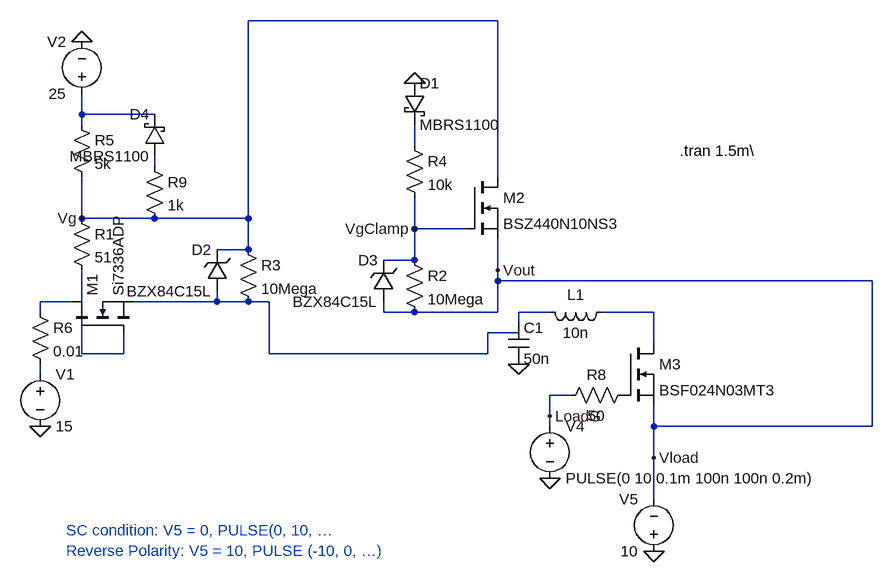
[diagram p0: schematic Clamp Sim.asc]
Clamp Sim.asc, the LTspice schematic file:
Version 4
SHEET 1 1028 680
WIRE 448 -192 64 -192
WIRE -192 -48 -192 -80
WIRE -80 -48 -192 -48
WIRE -192 -32 -192 -48
WIRE 320 0 320 -32
WIRE -80 32 -80 16
WIRE 448 48 448 -192
WIRE -192 112 -192 48
WIRE -80 112 -192 112
WIRE 64 112 64 -192
WIRE 64 112 -80 112
WIRE 320 128 320 80
WIRE 400 128 320 128
WIRE 64 160 64 112
WIRE 64 160 16 160
WIRE 320 176 320 128
WIRE 320 176 272 176
WIRE 448 192 448 144
WIRE 448 208 448 192
WIRE 1024 208 448 208
WIRE -208 240 -256 240
WIRE 16 240 16 224
WIRE 16 240 -112 240
WIRE 64 240 16 240
WIRE 96 240 64 240
WIRE -256 256 -256 240
WIRE 272 256 272 240
WIRE 320 256 272 256
WIRE 448 256 448 208
WIRE 448 256 320 256
WIRE 528 256 480 256
WIRE 688 256 608 256
WIRE 480 272 480 256
WIRE 480 288 432 288
WIRE 688 304 688 256
WIRE -192 320 -192 192
WIRE -128 320 -128 288
WIRE -128 320 -192 320
WIRE 96 320 96 240
WIRE 432 320 432 288
WIRE 432 320 96 320
WIRE -256 352 -256 336
WIRE 560 384 528 384
WIRE 528 416 528 384
WIRE 528 432 528 416
WIRE 688 432 688 400
WIRE 1024 432 1024 208
WIRE 1024 432 688 432
WIRE 688 480 688 432
WIRE 688 544 688 480
FLAG -256 432 0
FLAG 320 -96 0
FLAG -192 -160 0
FLAG 480 336 0
FLAG 528 512 0
FLAG 688 624 0
FLAG 320 128 VgClamp
FLAG 448 192 Vout
FLAG -192 112 Vg
FLAG 528 416 LoadG
FLAG 688 480 Vload
SYMBOL nmos -208 288 R270
SYMATTR InstName M1
SYMATTR Value Si7336ADP
SYMBOL nmos 400 48 R0
SYMATTR InstName M2
SYMATTR Value BSZ440N10NS3
SYMBOL Voltage -256 336 R0
SYMATTR InstName V1
SYMATTR Value 15
SYMBOL Res 304 160 R0
SYMATTR InstName R2
SYMATTR Value 10Mega
SYMBOL schottky 304 -96 R0
SYMATTR InstName D1
SYMATTR Value MBRS1100
SYMATTR Description Diode
SYMATTR Type diode
SYMBOL zener 288 240 R180
WINDOW 0 24 64 Left 2
WINDOW 3 24 0 Left 2
SYMATTR InstName D3
SYMATTR Value BZX84C15L
SYMBOL Res 48 144 R0
SYMATTR InstName R3
SYMATTR Value 10Mega
SYMBOL zener 32 224 R180
WINDOW 0 24 64 Left 2
WINDOW 3 24 0 Left 2
SYMATTR InstName D2
SYMATTR Value BZX84C15L
SYMBOL Res 304 -16 R0
SYMATTR InstName R4
SYMATTR Value 10k
SYMBOL Res -208 -48 R0
SYMATTR InstName R5
SYMATTR Value 5k
SYMBOL Voltage -192 -64 R180
WINDOW 0 24 96 Left 2
WINDOW 3 24 16 Left 2
SYMATTR InstName V2
SYMATTR Value 25
SYMBOL Res -272 240 R0
SYMATTR InstName R6
SYMATTR Value 0.01
SYMBOL ind 624 240 R90
WINDOW 0 5 56 VBottom 2
WINDOW 3 32 56 VTop 2
SYMATTR InstName L1
SYMATTR Value 10n
SYMATTR SpiceLine Rser=0.01m
SYMBOL Cap 464 272 R0
SYMATTR InstName C1
SYMATTR Value 50n
SYMBOL nmos 640 304 R0
SYMATTR InstName M3
SYMATTR Value BSF024N03MT3
SYMBOL Voltage 528 416 R0
SYMATTR InstName V4
SYMATTR Value PULSE(0 10 0.1m 100n 100n 0.2m)
SYMBOL Res -208 96 R0
SYMATTR InstName R1
SYMATTR Value 51
SYMBOL Res 656 368 R90
WINDOW 0 0 56 VBottom 2
WINDOW 3 32 56 VTop 2
SYMATTR InstName R8
SYMATTR Value 50
SYMBOL Res -96 16 R0
SYMATTR InstName R9
SYMATTR Value 1k
SYMBOL schottky -64 16 R180
WINDOW 0 24 64 Left 2
WINDOW 3 24 0 Left 2
SYMATTR InstName D4
SYMATTR Value MBRS1100
SYMATTR Description Diode
SYMATTR Type diode
SYMBOL Voltage 688 640 R180
WINDOW 0 24 96 Left 2
WINDOW 3 24 16 Left 2
SYMATTR InstName V5
SYMATTR Value 10
TEXT 728 8 Left 2 !.tran 1.5m\\
TEXT -216 592 Left 2 ;SC condition: V5 = 0, PULSE(0, 10, …\nReverse Polarity: V5 = 10, PULSE (-10, 0, …)

The netlist it stands for:
* Clamp Sim.asc
M1 N004 N008 N005 N005 Si7336ADP
M2 Vg VgClamp Vload Vload BSZ440N10NS3
V1 N009 0 15
R2 VgClamp Vload 10Mega
D1 0 N002 MBRS1100
D3 Vload VgClamp BZX84C15L
R3 Vg N005 10Mega
D2 N005 Vg BZX84C15L
R4 N002 VgClamp 10k
R5 N001 Vg 5k
V2 N001 0 25
R6 N004 N009 0.01
L1 N007 N006 10n Rser=0.01m
C1 N006 0 50n
M3 N007 P001 Vload Vload BSF024N03MT3
V4 LoadG 0 PULSE(0 10 0.1m 100n 100n 0.2m)
R1 Vg N008 51
R8 P001 LoadG 50
R9 N003 Vg 1k
D4 N003 N001 MBRS1100
V5 0 Vload 10
.model D D
.lib standard.dio
.model NMOS NMOS
.model PMOS PMOS
.lib standard.mos
.tran 1.5m\
* SC condition: V5 = 0, PULSE(0, 10, …
* Reverse Polarity: V5 = 10, PULSE (-10, 0, …)
.backanno
.end